# Altium schematic sheet power.SchDoc
size A4; Organization: Altium Limited; Address1: L3, 12a Rodborough Rd; Address2: Frenchs Forest; Address3: NSW; Address4: Australia 2086
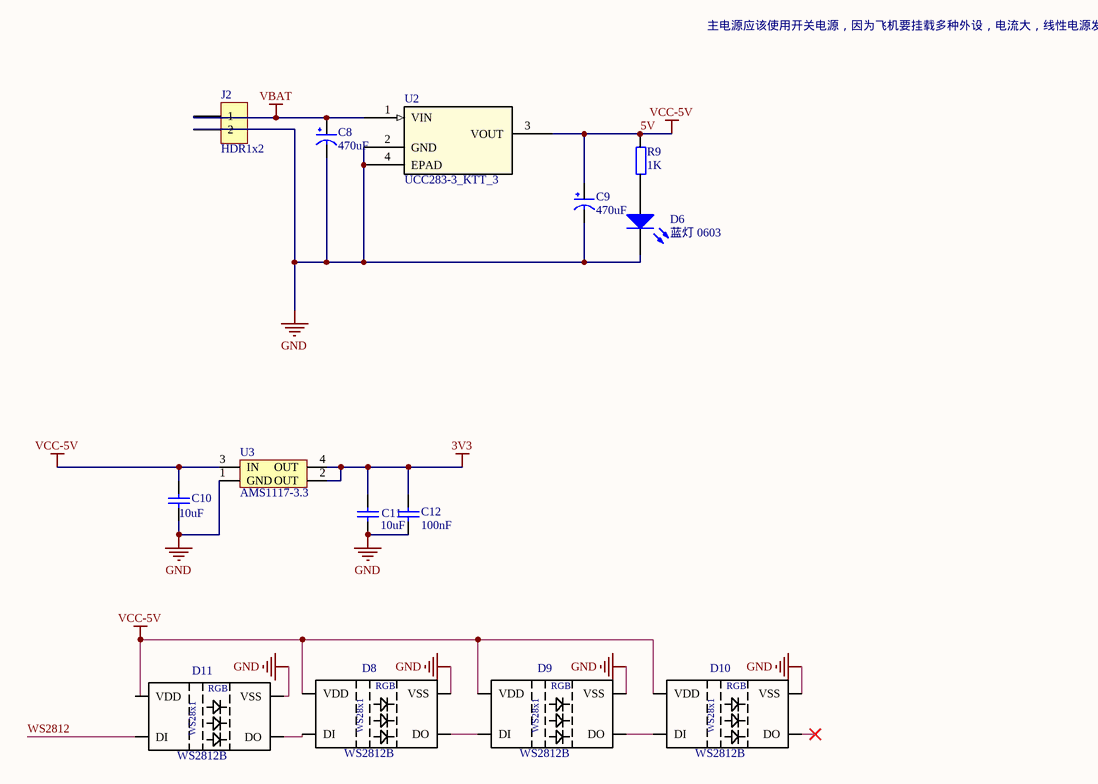
[diagram p0: power.SchDoc]

## Parts
C8  470uF  [CC6.56.5]
C9  470uF  [CC6.56.5]
C10  10uF  [0603_C]
C11  10uF  [0603_C]
C12  100nF  [0603_C]
D6  蓝灯 0603  [0603_LED_S1]
D8  WS2812B  [WS2812B]
D9  WS2812B  [WS2812B]
D10  WS2812B  [WS2812B]
D11  WS2812B  [WS2812B]
J2  HDR1x2  [Head_Small]
R9  1K  [0805_R]
U2  UCC283-3_KTT_3  [TO-263-3]
U3  AMS1117-3.3  [AMS1117]

## Nets
3V3: C11.2 C12.2 U3.2(OUT) U3.4(OUT)
5V: C9.1(VCC) C10.2 D8.1(VDD) D9.1(VDD) D10.1(VDD) D11.1(VDD) R9.2 U2.3(VOUT) U3.3(IN)  [also labelled VCC-5V]
GND: C8.2(GND) C9.2(GND) C10.1 C11.1 C12.1 D6.K D8.3(VSS) D9.3(VSS) D10.3(VSS) D11.3(VSS) J2.2 U2.2(GND) U2.4(EPAD) U3.1(GND)
VBAT: C8.1(VCC) J2.1 U2.1(VIN)
WS2812: D11.4(DI)
NetD6_A: D6.A R9.1
NetD8_2: D8.2(DO) D9.4(DI)
NetD8_4: D8.4(DI) D11.2(DO)
NetD9_2: D9.2(DO) D10.4(DI)

Not connected (* = marked no-connect by the designer): D10 2(DO)*

## Notes on the sheet
- 主电源应该使用开关电源，因为飞机要挂载多种外设，电流大，线性电源发热大，ws2812应该使用外挂灯带，便于观察
- Title
- Size:
- Date:
- A4
- Number:
- Time:
- Revision:
- Sheet
- of
- File:
- (in symbol WS2812B) RGB; WS28x1

## Library data of the parts
C8 C9 = CAP
C10 C11 = 0603 10uF (106) 10% 10V: 贴片电容; ComponentLink1Description: 供应商链接; ComponentLink1URL: http://www.szlcsc.com/product/details_20411.html; Package: 0603; Supplier: LC; SuppliersPartNumber: C19702
C12 = 0603 100nF (104) 10% 50V: 贴片电容; ComponentLink1Description: 供应商链接; ComponentLink1URL: http://www.szlcsc.com/product/details_15331.html; Package: 0603; Supplier: LC; SuppliersPartNumber: C14663
D6 = 0603 蓝灯: 发光二极管; ComponentLink1Description: 供应商链接; ComponentLink1URL: http://www.szlcsc.com/product/details_73150.html; Package: 0603; Supplier: LC; SuppliersPartNumber: C72041
D8-D11 = WS2812B: Intelligent Control Led Integrated Light Source Pack Of 10; MF: Seeed Technology; Price: None; MP: WS2812B; SnapEDA_Link: https://www.snapeda.com/parts/WS2812B/Seeed%20Technology%20Co.%2C%20Ltd/view-part/?ref=snap; Package: None; Availability: Unavailable; Value: *
J2 = HDR1x2: Connector
R9 = R
U2 = UCC283-3_KTT_3: Imported; Vendor: Texas Instruments; PACKAGE_DESIGNATOR: KTT; PIN_COUNT: 3; FAMILY_NAME: SINGLE CHANNEL LDO; INDUSTRY_STD_PKG_TYPE: DDPAK/TO-263; Manufacturer_Part_Number: ucc283-3_ktt_3; GENERIC_PART_NUMBER: UCC283-3; Manufacturer: Texas Instruments; Datasheet_URL: http://www.ti.com/lit/gpn/UCC283-3; Value: Value; Type: Type; RefDes: RefDes
U3 = AMS1117